# EAGLE design Power_Dev_revA.3 (EAGLE 9.1.0)
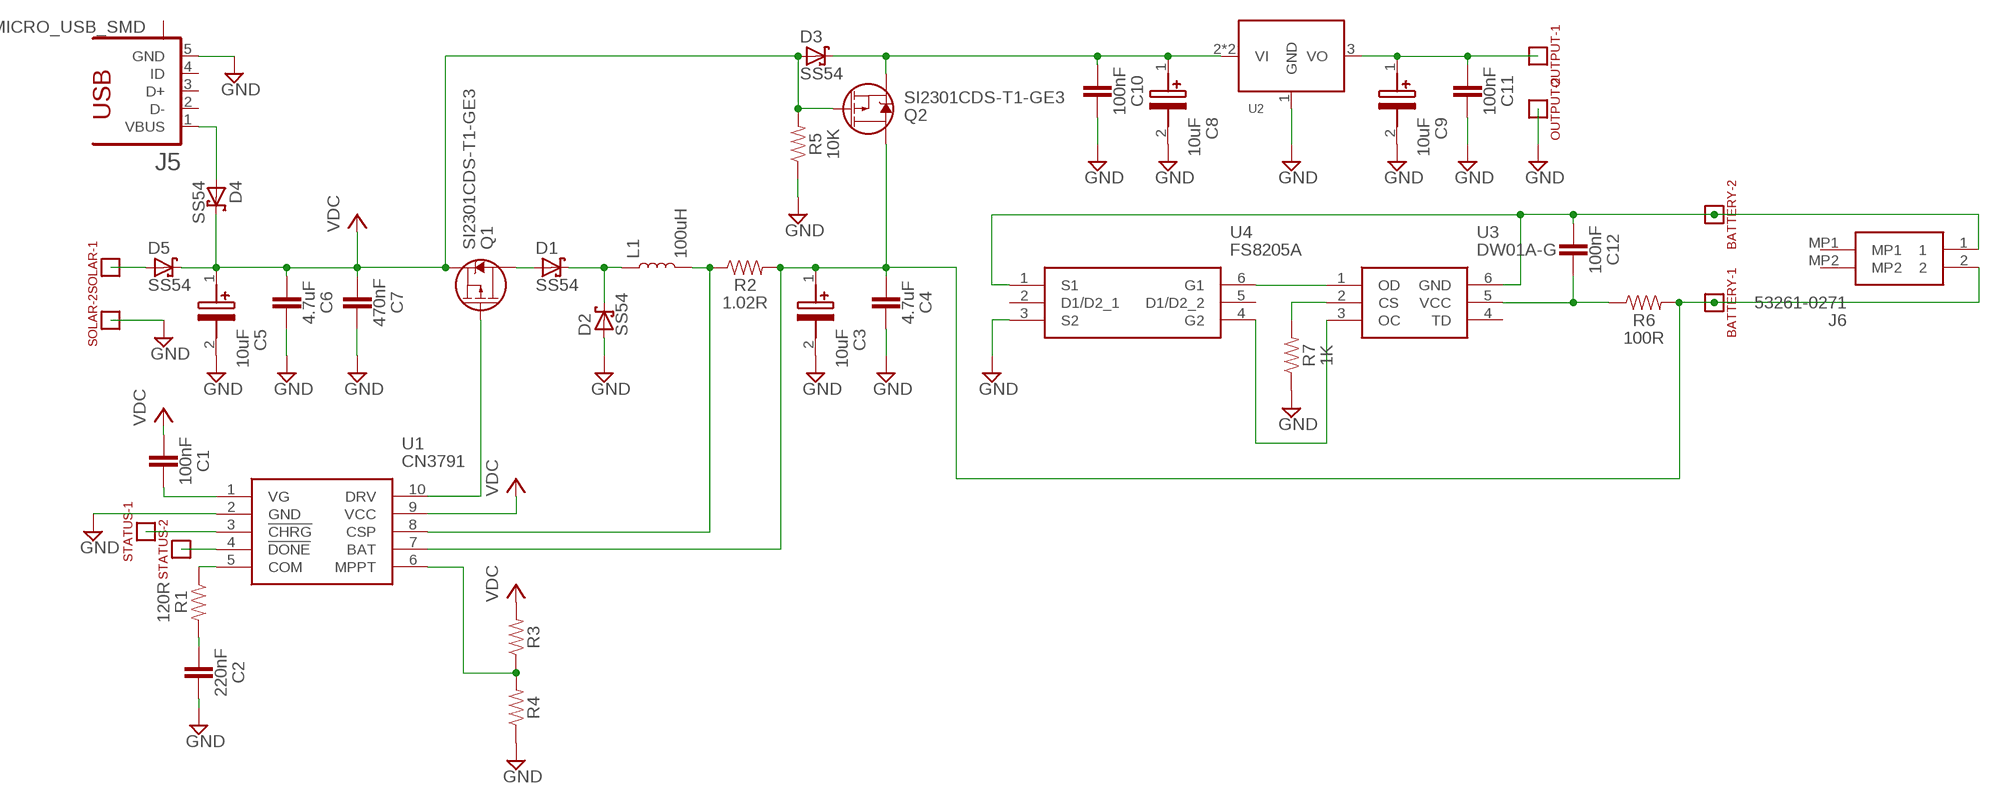
[diagram p0: schematic, sheet 1]

## Parts
BATTERY  HEADER_2PIN  [HEADER_2PIN]
C1  100nF  C_0402  [0402]
C2  220nF  C_0603  [0603]
C3  10uF  6.3MM_SMD_ECAP  [6MM_SMD_ECAP]
C4  4.7uF  C_1206  [1206]
C5  10uF  6.3MM_SMD_ECAP  [6MM_SMD_ECAP]
C6  4.7uF  C_1206  [1206]
C7  470nF  C_0805  [0805]
C8  10uF  6.3MM_SMD_ECAP  [6MM_SMD_ECAP]
C9  10uF  6.3MM_SMD_ECAP  [6MM_SMD_ECAP]
C10  100nF  C_0402  [0402]
C11  100nF  C_0402  [0402]
C12  100nF  C_0402  [0402]
D1  SS54  DIODE_SCHOTTKY_SMA  [SMA(DO-214AC)]
D2  SS54  DIODE_SCHOTTKY_SMA  [SMA(DO-214AC)]
D3  SS54  DIODE_SCHOTTKY_SMA  [SMA(DO-214AC)]
D4  SS54  DIODE_SCHOTTKY_SMA  [SMA(DO-214AC)]
D5  SS54  DIODE_SCHOTTKY_SMA  [SMA(DO-214AC)]
J5  MICRO_USB_SMD  [10118192-0002LF]
J6  53261-0271  [532610271]
L1  100uH  L_SMD,7X7.8MM  [L_SMD,7X7.8MM]
OUTPUT  HEADER_2PIN  [HEADER_2PIN]
Q1  SI2301CDS-T1-GE3  MOSFET_P_SOT23  [SOT-23]
Q2  SI2301CDS-T1-GE3  MOSFET_P_SOT23  [SOT-23]
R1  120R  R_0805  [0805]
R2  1.02R  R_1206  [1206]
R3  RESISTOR_TH  [RESISTOR_TH]
R4  RESISTOR_TH  [RESISTOR_TH]
R5  10K  R_0402  [0402]
R6  100R  R_0402  [0402]
R7  1K  R_0402  [0402]
SOLAR  HEADER_2PIN  [HEADER_2PIN]
STATUS  HEADER_2PIN  [HEADER_2PIN]
U1  CN3791  [SOP100P600X175-10N]
U2  LDO_SOT89  [SOT-89-3]
U3  DW01A-G  [SOT95P280X135-6N]
U4  FS8205A  [SOT95P280X125-6N]

## Nets
GND: C2.2 C3.2(-) C4.2 C5.2(-) C6.2 C7.2 C8.2(-) C9.2(-) C10.2 C11.2 D2.2(A) J5.5(GND) OUTPUT.P$2 R4.P$1 R5.1 R7.1 SOLAR.P$2 U1.2(GND) U2.1(GND) U4.3(S2)
N$1: D4.2(A) J5.1(VBUS)
N$2: D5.2(A) SOLAR.P$1
N$3: D1.2(A) Q1.3(D)
N$4: D1.1(C) D2.1(C) L1.P$1
N$5: L1.P$2 R2.1 U1.8(CSP)
N$6: C9.1(+) C11.1 OUTPUT.P$1 U2.3(VO)
N$7: Q1.1(G) U1.10(DRV)
N$8: C8.1(+) C10.1 D3.1(C) Q2.2(S) U2.2(VI) U2.4(VI)
N$9: R1.1 U1.5(COM)
N$10: C2.1 R1.2
N$11: STATUS.P$1 U1.3(!CHRG)
N$12: STATUS.P$2 U1.4(!DONE)
N$13: C1.2 U1.1(VG)
N$14: R3.P$1 R4.P$2 U1.6(MPPT)
N$15: R7.2 U3.2(CS)
N$16: U3.3(OC) U4.4(G2)
N$17: U3.1(OD) U4.6(G1)
N$18: BATTERY.P$2 C12.1 J6.1 U3.6(GND) U4.1(S1)
N$19: C12.2 R6.1 U3.5(VCC)
N$20: BATTERY.P$1 C3.1(+) C4.1 J6.2 Q2.3(D) R2.2 R6.2 U1.7(BAT)
VDC: C1.1 C5.1(+) C6.1 C7.1 D3.2(A) D4.1(C) D5.1(C) Q1.2(S) Q2.1(G) R3.P$2 R5.2 U1.9(VCC)
Unconnected: J5.2(D-) J5.3(D+) J5.4(ID) J5.S1 J6.MP1 J6.MP2 U3.4(TD) U4.2(D1/D2_1) U4.5(D1/D2_2)

## Library data of the parts
BATTERY OUTPUT SOLAR STATUS = NSE LABS:HEADER_2PIN
C1 C10-C12 = NSE LABS:C_0402: Samsung Source: Datasheet <https://datasheet.lcsc.com/szlcsc/Samsung-Electro-Mechanics-CL05B104KB54PNC_C307331.pdf>
C2 = NSE LABS:C_0603
C3 C5 C8 C9 = NSE LABS:6.3MM_SMD_ECAP
C4 C6 = NSE LABS:C_1206
C7 = NSE LABS:C_0805
D1-D5 = NSE LABS:DIODE_SCHOTTKY_SMA
J5 = NSE LABS:MICRO_USB_SMD: Receptacle, micro-USB, type A/B Tyco Electronics
J6 = NSE LABS:53261-0271: 1.25mm Pitch, PicoBlade PCB Header, Single Row, Right-Angle, Surface Mount, Tin (Sn) Plating, Friction Lock, Circuits, Tape and Reel Source: Datasheet <https://www.molex.com/pdm_docs/sd/532610271_sd.pdf>; ARROW_PART_NUMBER: 53261-0271; ARROW_PRICE-STOCK: https://www.arrow.com/en/products/53261-0271/molex?region=nac; DESCRIPTION: 1.25mm Pitch, PicoBlade PCB Header, Single Row, Right-Angle, Surface Mount, Tin (Sn) Plating, Friction Lock, Circuits, Tape and Reel; HEIGHT: 3.65mm; MANUFACTURER_NAME: Molex; MANUFACTURER_PART_NUMBER: 53261-0271; MOUSER_PART_NUMBER: 538-53261-0271; MOUSER_PRICE-STOCK: https://www.mouser.co.uk/ProductDetail/Molex/53261-0271?qs=%252B72YyncTwW%252B8%252BBjraxGf3A%3D%3D
L1 = NSE LABS:L_SMD,7X7.8MM
Q1 Q2 = NSE LABS:MOSFET_P_SOT23
R1 = NSE LABS:R_0805
R2 = NSE LABS:R_1206
R3 R4 = NSE LABS:RESISTOR_TH
R5-R7 = NSE LABS:R_0402
U1 = NSE LABS:CN3791: ic Source: Datasheet <http://www.consonance-elec.com/pdf/datasheet/DSE-CN3791.pdf>; DESCRIPTION: ic; HEIGHT: 1.75mm; MANUFACTURER_NAME: Consonance; MANUFACTURER_PART_NUMBER: CN3791
U2 = NSE LABS:LDO_SOT89
U3 = NSE LABS:DW01A-G: One Cell Lithium-ion/Polymer Battery Protection IC Source: Datasheet <http://acoptex.com/uploads/DW01A.pdf>; DESCRIPTION: One Cell Lithium-ion/Polymer Battery Protection IC; HEIGHT: 1.35mm; MANUFACTURER_NAME: Fortune Semiconductor Corporation; MANUFACTURER_PART_NUMBER: DW01A-G
U4 = NSE LABS:FS8205A: Dual N-Channel Enhancement Power Mosfet Source: Datasheet <http://www.techpublic.com.tw/pdf/FS8205A.pdf>; DESCRIPTION: Dual N-Channel Enhancement Power Mosfet; HEIGHT: 1.25mm; MANUFACTURER_NAME: TECH PUBLIC; MANUFACTURER_PART_NUMBER: FS8205A

## Board
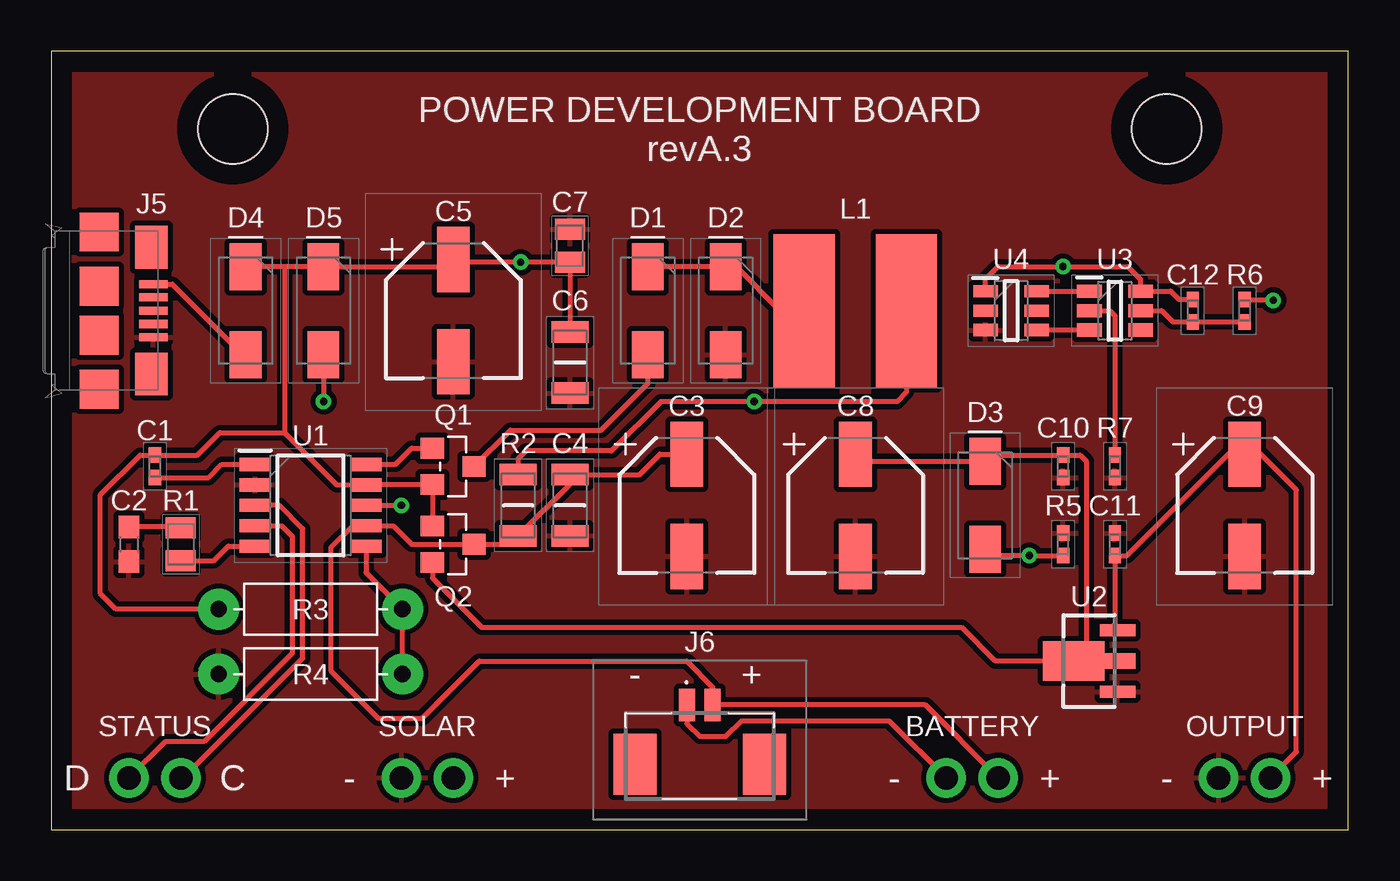
[diagram p1: board, top side]
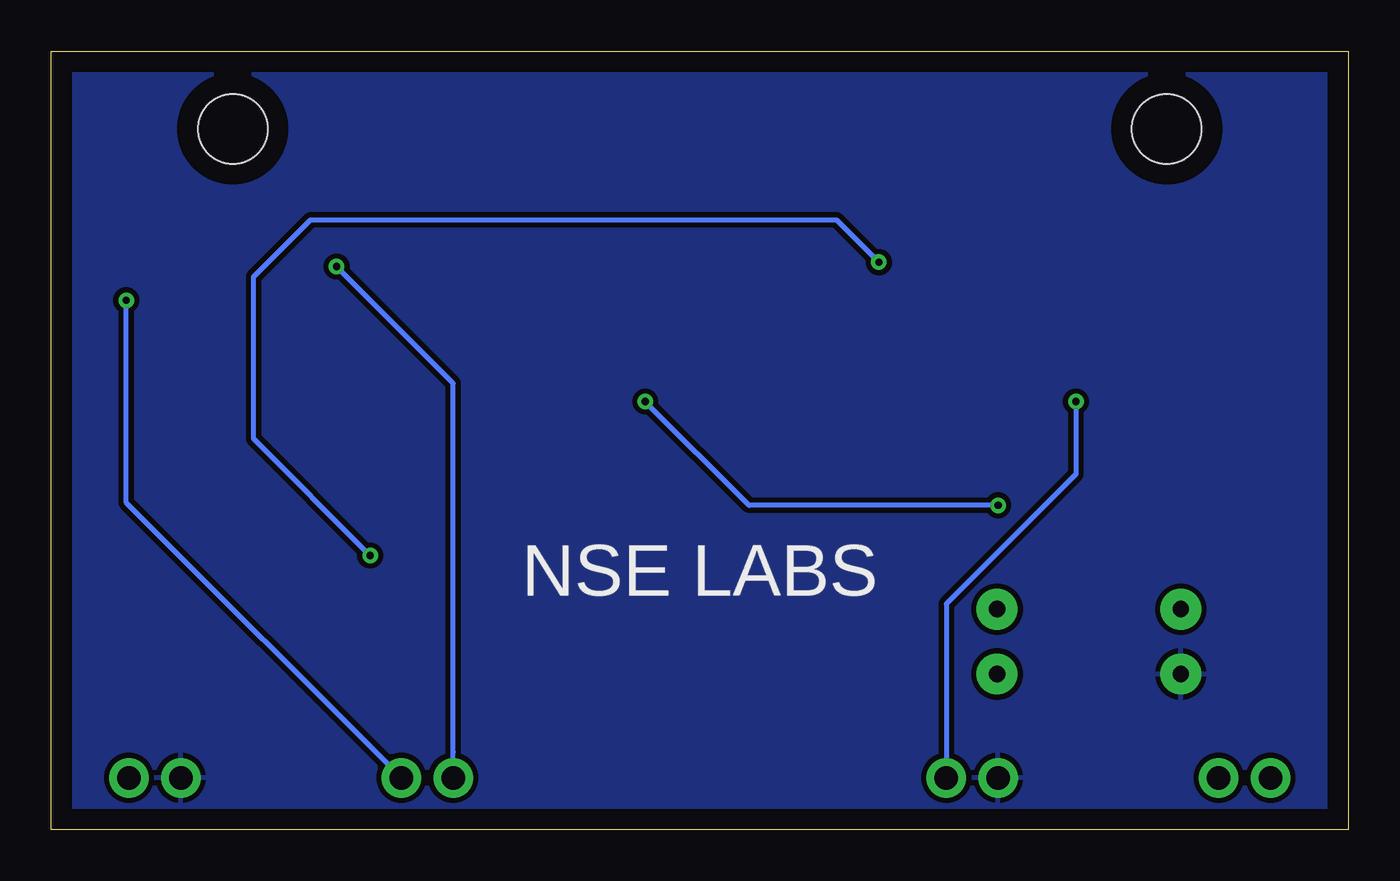
[diagram p2: board, bottom side, seen from below]

Size 63.5 x 38.1 mm. Coordinates in mm from the lower left corner, seen from the top.
Outline: 0,0 63.5,0 63.5,38.1 0,38.1 0,0
Copper layers (1*16): Top 0.035mm / dielectric 1.5mm / Bottom 0.035mm
Design rules "default": minimum track width 6mil, minimum drill 0.35mm, track to track 6mil, track to pad 6mil, pad to pad 6mil, via to via 6mil, smd to smd 6mil, copper to edge 40mil, drill to drill 6mil, minimum pad ring 10mil, minimum via ring 8mil, stop-mask expansion 4mil, vias tented up to drill 0mil, thermal gap 10mil
Holes 3.4 mm at 8.89,34.29 54.61,34.29

### Footprints (pad centres in the part's own frame; a part is rotated, then mirrored left to right if it is on the bottom)
HEADER_2PIN = drill 1.143 pad 1.93: P$1 -1.27,0; P$2 1.27,0
0402 = smd 0.75 x 0.6: 1 -0.55,0; 2 0.55,0
0603 = smd 1.1 x 1: 1 -0.85,0; 2 0.85,0
6MM_SMD_ECAP = smd 3.2 x 1.6: 1 -2.5,0; 2 2.5,0
1206 = smd 1.05 x 1.8: 1 -1.5,0; 2 1.5,0
0805 = smd 1.02 x 1.47: 1 -0.8,0; 2 0.8,0
SMA(DO-214AC) = smd 2.3 x 1.55: 1 -2.15,0; 2 2.15,0
10118192-0002LF = smd 0.4 x 1.4: 1 -1.3,1.2; 2 -0.65,1.2; 3 0,1.2; 4 0.65,1.2; 5 1.3,1.2 | smd 1.9 x 1.9: M1 -1.2,-1.45; M2 1.2,-1.45; S1 -3.85,-1.45; S2 3.85,-1.45 | smd 2.1 x 1.6: S3 -3.1,1.1; S4 3.1,1.1
532610271 = smd 0.8 x 1.6: 1 0.625,-1.538; 2 -0.625,-1.538 | smd 2.1 x 3: MP1 3.175,1.362; MP2 -3.175,1.362
L_SMD,7X7.8MM = smd 3 x 7.5: P$1 -2.5,0; P$2 2.5,0
SOT-23 = smd 1.016 x 1.143: 1 -0.889,-1.016; 2 0.889,-1.016; 3 0,1.016
RESISTOR_TH = drill 0.8 pad 2: P$1 -4.5,0; P$2 4.5,0
SOP100P600X175-10N = smd 1.525 x 0.65: 1 -2.712,2; 2 -2.712,1; 3 -2.712,0; 4 -2.712,-1; 5 -2.712,-2; 6 2.712,-2; 7 2.712,-1; 8 2.712,0; 9 2.712,1; 10 2.712,2
SOT-89-3 = smd 0.58 x 1.73: 1 -1.5,-1.4; 3 1.5,-1.4 | smd 0.76 x 1.5: 2 0,-1.515 | smd 1.933 x 3.03: 4 0,0.75
SOT95P280X135-6N = smd 1.2 x 0.65: 1 -1.25,0.95; 2 -1.25,0; 3 -1.25,-0.95; 4 1.25,-0.95; 5 1.25,0; 6 1.25,0.95
SOT95P280X125-6N = smd 1.2 x 0.6: 1 -1.25,0.95; 2 -1.25,0; 3 -1.25,-0.95; 4 1.25,-0.95; 5 1.25,0; 6 1.25,0.95

### Placement (x,y rotation side)
BATTERY  45.09,2.54 180 top
C1  5.08,17.78 270 top
C2  3.81,13.97 270 top
C3  31.11,15.88 270 top
C4  25.4,15.88 270 top
C5  19.68,25.4 270 top
C6  25.4,22.86 270 top
C7  25.4,28.57 90 top
C8  39.37,15.88 270 top
C9  58.42,15.88 270 top
C10  49.53,17.78 270 top
C11  52.07,13.97 90 top
C12  55.88,25.4 270 top
D1  29.21,25.4 270 top
D2  33.02,25.4 270 top
D3  45.72,15.88 270 top
D4  9.53,25.4 270 top
D5  13.34,25.4 270 top
J5  3.81,25.4 270 top
J6  31.75,4.57 180 top
L1  39.37,25.4 0 top
OUTPUT  58.42,2.54 180 top
Q1  19.68,17.78 270 top
Q2  19.68,13.97 270 top
R1  6.35,13.97 90 top
R2  22.86,15.88 270 top
R3  12.7,10.79 180 top
R4  12.7,7.62 0 top
R5  49.53,13.97 270 top
R6  58.42,25.4 90 top
R7  52.07,17.78 90 top
SOLAR  18.41,2.54 180 top
STATUS  5.08,2.54 180 top
U1  12.7,15.88 0 top
U2  50.8,8.26 90 top
U3  52.07,25.4 0 top
U4  46.99,25.4 0 top

### Tracks (layer width: path | path; a pad name or v marks a point on that pad's centre or on a via)
GND
  pour Top (isolate 0.254): 0,0 63.5,0 63.5,38.1 0,38.1
  pour Bottom (isolate 0.254): 0,0 0,38.1 63.5,38.1 63.5,0
N$1
  Top 0.254: J5.1 5.94,26.7 9.39,23.25 D4.2
N$2  (via drill 0.35)
  Top 0.254: D5.2 v13.34,20.95
  Bottom 0.254: v13.34,20.95 13.34,17.4 19.68,11.05 SOLAR.P$1
N$3
  Top 0.254: Q1.3 22.48,19.56 26.92,19.56 29.21,21.84 D1.2
N$4
  Top 0.254: D2.1 D1.1 | 33.54,27.55 35.69,25.4
  Top 0.508: D2.1 33.54,27.55 | 35.69,25.4 L1.P$1
N$5  (via drill 0.35)
  Top 0.254: L1.P$2 41.87,21.42 41.4,20.95 v34.42,20.95 29.84,20.95 27.43,18.54 23.24,18.54 22.86,18.16 R2.1 | U1.8 v17.14,15.88
  Bottom 0.254: v17.14,15.88 29.34,15.88 v34.42,20.95
N$6
  Top 0.254: 52.07,9.88 C11.1 52.66,13.42 57.62,18.38 C9.1 59.22,18.38 60.96,16.64 60.96,3.81 OUTPUT.P$1
  Top 0.508: 52.07,9.88 U2.3
N$7
  Top 0.254: 15.51,17.78 U1.10 16.86,17.88 17.65,18.67 Q1.1
N$8
  Top 0.254: 39.72,18.02 D3.1 46.02,18.33 C10.1 50.38,18.33 50.67,18.03 50.67,8.89 50.04,8.26 U2.4 | U2.2 U2.4 | U2.4 46.23,8.26 44.58,9.91 21.08,9.91 18.67,12.32 Q2.2
  Top 0.508: C8.1 39.72,18.02
N$9
  Top 0.254: R1.1 7.96,13.17 8.67,13.88 U1.5
N$10
  Top 0.254: 6.3,14.82 C2.1
  Top 0.508: R1.2 6.3,14.82
N$11
  Top 0.254: STATUS.P$1 6.48,2.54 12.32,8.38 12.32,14.73 11.18,15.88 U1.3
N$12
  Top 0.254: U1.4 11.29,14.88 11.81,14.35 11.81,8.64 7.49,4.32 5.59,4.32 STATUS.P$2
N$13
  Top 0.254: C1.2 7.71,17.23 8.35,17.88 U1.1
N$14
  Top 0.254: R4.P$2 R3.P$1 15.41,12.58 U1.6
N$15
  Top 0.254: U3.2 51.82,25.4 52.07,25.15 R7.2
N$16
  Top 0.254: U3.3 U4.4
N$17
  Top 0.254: U4.6 U3.1
N$18  (via drill 0.35)
  Top 0.254: C12.1 55.2,25.95 54.8,26.35 U3.6 53.32,26.94 52.7,27.56 v49.53,27.56 46.35,27.56 45.74,26.94 U4.1 | J6.1 31.12,5.2 31.75,4.57 33.02,4.57 33.78,5.33 41.02,5.33 BATTERY.P$2
  Bottom 0.254: v49.53,27.56 43.81,21.84 43.81,3.81 BATTERY.P$2
N$19
  Top 0.254: U3.5 54.36,25.4 54.91,24.85 C12.2 R6.1
N$20  (via drill 0.35)
  Top 0.254: C3.1 29.8,18.38 28.8,17.38 C4.1 25.4,16.91 R2.2 22.45,13.97 Q2.3 17.65,13.97 16.75,14.88 U1.7 14.75,14.88 13.72,13.84 13.72,7.75 16,5.46 18.16,5.46 20.95,8.26 31.11,8.26 32.38,6.99 J6.2 | v59.82,25.91 58.46,25.91 R6.2 | BATTERY.P$1 42.78,6.11 J6.2 | J6.2
  Bottom 0.254: BATTERY.P$1 59.82,16 v59.82,25.91
VDC  (via drill 0.35)
  Top 0.254: 11.43,19.43 8.26,19.43 7.15,18.33 C1.1 4.36,18.33 2.41,16.38 2.41,11.56 3.17,10.79 R3.P$2 | 11.43,19.43 13.99,16.88 U1.9 15.43,16.89 Q1.2 Q2.1 | 11.43,19.43 11.43,27.55 11.56,27.55 | C6.1 C7.1 v22.99,27.77 19.81,27.77 C5.1 19.34,27.55 D5.1 11.56,27.55 | 11.56,27.55 D4.1 | R5.2 v47.88,13.42 46.02,13.42 D3.2
  Bottom 0.254: v47.88,13.42 53.59,19.14 53.59,27.05 50.8,29.84 25.06,29.84 v22.99,27.77

### Text on the board
tPlace: POWER DEVELOPMENT BOARD / revA.3 | - | + | D | C | - | + | - | + | - | +
bPlace: NSE LABS